# EAGLE board SensorBoard (EAGLE 6.5.0)
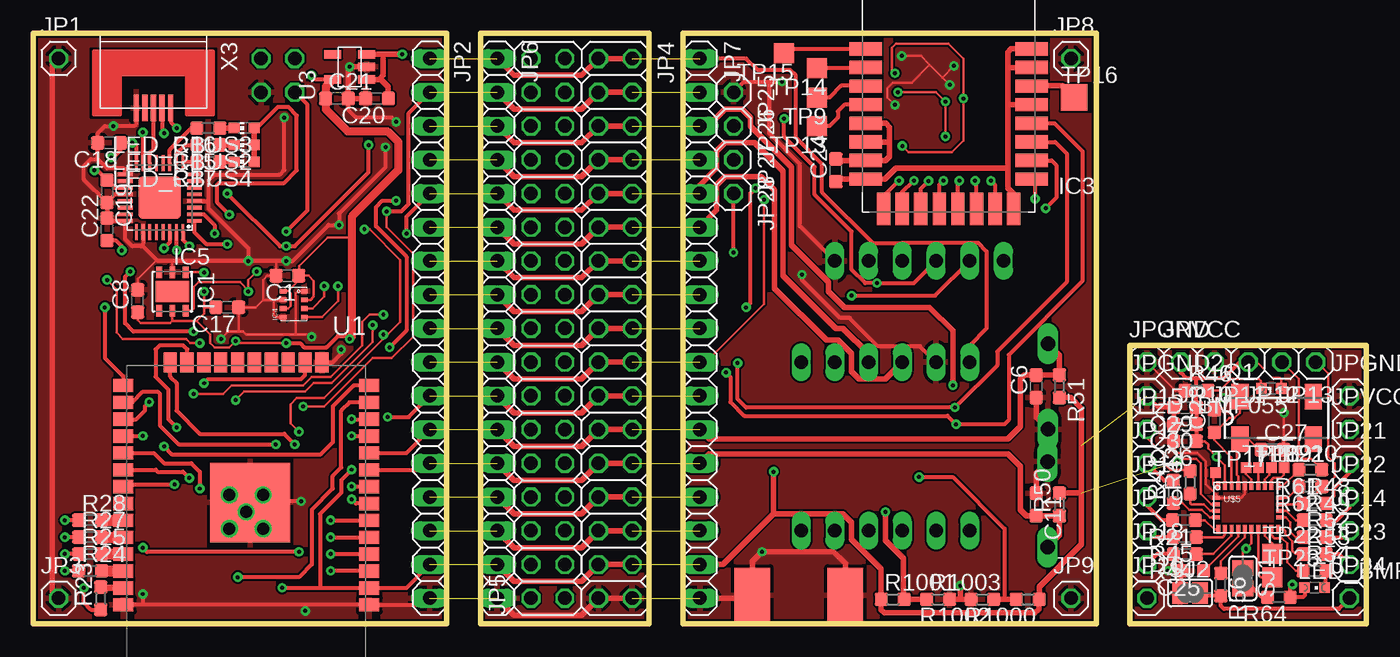
[diagram p4: board, top side]
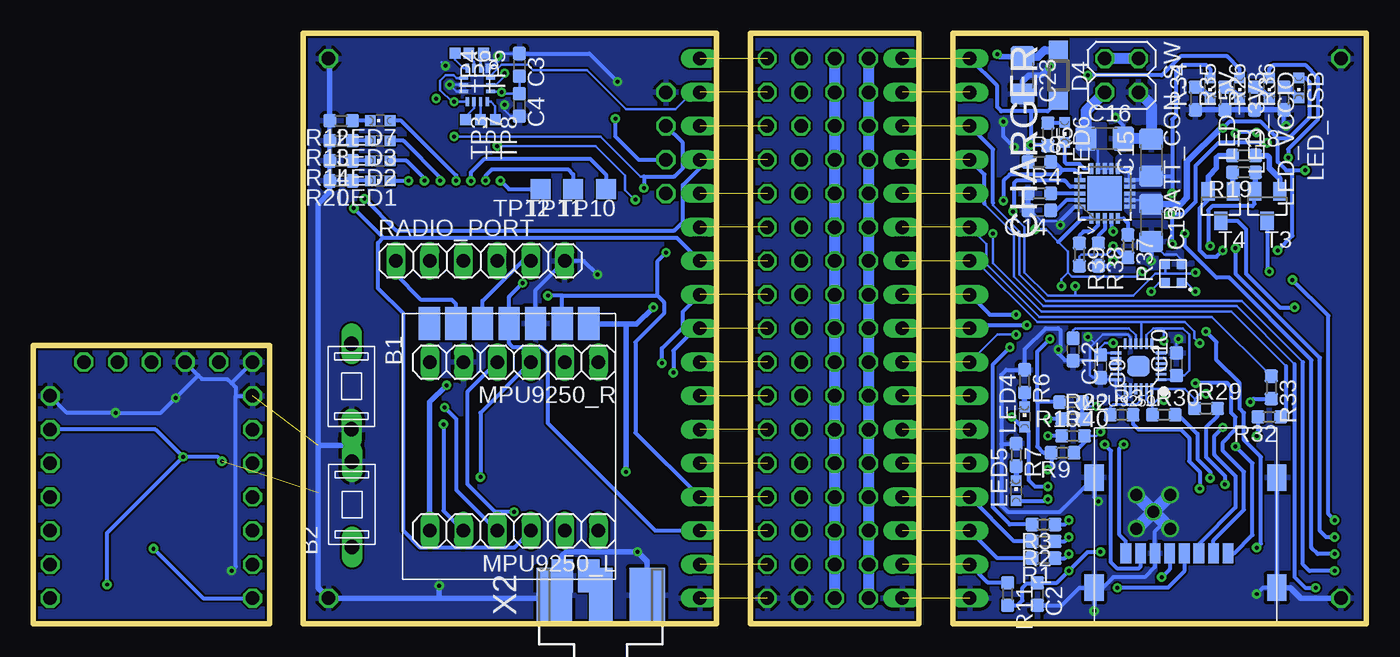
[diagram p5: board, bottom side, seen from below]

Size 100.33 x 44.45 mm. Coordinates in mm from the lower left corner, seen from the top.
Outline: 80.01,0 80.01,44.45 48.9,44.45 48.9,0 80.01,0
Outline: 46.35,0 46.35,44.45 33.66,44.45 33.66,0 46.35,0
Outline: 31.11,0 31.11,44.44 0,44.44 0,0 31.11,0
Outline: 82.55,0 100.33,0 100.33,20.95 82.55,20.95 82.55,0
Copper layers (1*16): Top 0.035mm / dielectric 1.5mm / Bottom 0.035mm
Design rules "gatema_2layers": minimum track width 0.15mm, minimum drill 0.3mm, track to track 0.15mm, track to pad 0.15mm, pad to pad 0.15mm, via to via 0.15mm, smd to smd 0mil, copper to edge 0.15mm, drill to drill 0.4mm, minimum pad ring 0.2mm, minimum via ring 0.2mm, stop-mask expansion 2mil, vias tented up to drill 0.4mm, thermal gap 10mil
bRestrict: 1 lines

## Footprints (pad centres in the part's own frame; a part is rotated, then mirrored left to right if it is on the bottom)
TACTM-35N-F = drill 1.1 long: P$2 3.231,-0.02; P$4 -3.204,-0.02
2X02 = drill 1.016 octagon: 1 -1.27,-1.27; 2 -1.27,1.27; 3 1.27,-1.27; 4 1.27,1.27
C0603 = smd 1 x 1: 1 -0.85,0; 2 0.85,0
C1206 = smd 1.6 x 1.8: 1 -1.4,0; 2 1.4,0
QFN50P400X400X80-21N = smd 0.813 x 0.305: 1 -1.88,0.991; 2 -1.88,0.508; 3 -1.88,0; 4 -1.88,-0.508; 5 -1.88,-0.991; 11 1.88,-0.991; 12 1.88,-0.508; 13 1.88,0; 14 1.88,0.508; 15 1.88,0.991 | smd 0.305 x 0.813: 6 -0.991,-1.88; 7 -0.508,-1.88; 8 0,-1.88; 9 0.508,-1.88; 10 0.991,-1.88; 16 0.991,1.88; 17 0.508,1.88; 18 0,1.88; 19 -0.508,1.88; 20 -0.991,1.88 | smd 2.591 x 2.591: 21 0,0
SOD123 = smd 1.4 x 1.4: A 1.9,0; C -1.9,0
DFN6-3X3 = smd 0.85 x 0.45: 1 -1.45,1; 2 -1.45,0; 3 -1.45,-1; 4 1.45,-1; 5 1.45,0; 6 1.45,1 | smd 1.6 x 2.5: EXP 0,0
DWM1000 = smd 2.45 x 1: 1 -6.25,0.8; 2 -6.25,-0.6; 3 -6.25,-2; 4 -6.25,-3.4; 5 -6.25,-4.8; 6 -6.25,-6.2; 7 -6.25,-7.6; 8 -6.25,-9; 17 6.25,-9; 18 6.25,-7.6; 19 6.25,-6.2; 20 6.25,-4.8; 21 6.25,-3.4; 22 6.25,-2; 23 6.25,-0.6; 24 6.25,0.8 | smd 1 x 2.45: 9 -4.9,-11.25; 10 -3.5,-11.25; 11 -2.1,-11.25; 12 -0.7,-11.25; 13 0.7,-11.25; 14 2.1,-11.25; 15 3.5,-11.25; 16 4.9,-11.25
BMP280 = smd 0.35 x 0.5: 1 0.975,-0.8; 2 0.325,-0.8; 3 -0.325,-0.8; 4 -0.975,-0.8; 5 -0.975,0.8; 6 -0.325,0.8; 7 0.325,0.8; 8 0.975,0.8
QFN32_LONG_PADS = smd 1.2 x 0.3: 1 -2.6,1.75; 2 -2.6,1.25; 3 -2.6,0.75; 4 -2.6,0.25; 5 -2.6,-0.25; 6 -2.6,-0.75; 7 -2.6,-1.25; 8 -2.6,-1.75; 17 2.6,-1.75; 18 2.6,-1.25; 19 2.6,-0.75; 20 2.6,-0.25; 21 2.6,0.25; 22 2.6,0.75; 23 2.6,1.25; 24 2.6,1.75 | smd 0.3 x 1.2: 9 -1.75,-2.6; 10 -1.25,-2.6; 11 -0.75,-2.6; 12 -0.25,-2.6; 13 0.25,-2.6; 14 0.75,-2.6; 15 1.25,-2.6; 16 1.75,-2.6; 25 1.75,2.6; 26 1.25,2.6; 27 0.75,2.6; 28 0.25,2.6; 29 -0.25,2.6; 30 -0.75,2.6; 31 -1.25,2.6; 32 -1.75,2.6 | smd 3.2 x 3.2: EXP 0,0
1X01 = drill 1.016 octagon: 1 0,0
1X17 = drill 1.016 long: 1 -20.32,0; 2 -17.78,0; 3 -15.24,0; 4 -12.7,0; 5 -10.16,0; 6 -7.62,0; 7 -5.08,0; 8 -2.54,0; 9 0,0; 10 2.54,0; 11 5.08,0; 12 7.62,0; 13 10.16,0; 14 12.7,0; 15 15.24,0; 16 17.78,0; 17 20.32,0
2X17 = drill 1.016 octagon: 1 -20.32,-1.27; 2 -20.32,1.27; 3 -17.78,-1.27; 4 -17.78,1.27; 5 -15.24,-1.27; 6 -15.24,1.27; 7 -12.7,-1.27; 8 -12.7,1.27; 9 -10.16,-1.27; 10 -10.16,1.27; 11 -7.62,-1.27; 12 -7.62,1.27; 13 -5.08,-1.27; 14 -5.08,1.27; 15 -2.54,-1.27; 16 -2.54,1.27; 17 0,-1.27; 18 0,1.27; 19 2.54,-1.27; 20 2.54,1.27; 21 5.08,-1.27; 22 5.08,1.27; 23 7.62,-1.27; 24 7.62,1.27; 25 10.16,-1.27; 26 10.16,1.27; 27 12.7,-1.27; 28 12.7,1.27; 29 15.24,-1.27; 30 15.24,1.27; 31 17.78,-1.27; 32 17.78,1.27; 33 20.32,-1.27; 34 20.32,1.27
CHIPLED_0603 = smd 0.8 x 0.8: A 0,-0.75; C 0,0.75
CHIP-LED0603 = smd 0.8 x 0.8: A 0,-0.75; C 0,0.75
LEAD-QFN24 = smd 0.8 x 0.2: 1 -1.7,1; 2 -1.7,0.6; 3 -1.7,0.2; 4 -1.7,-0.2; 5 -1.7,-0.6; 6 -1.7,-1; 13 1.7,-1; 14 1.7,-0.6; 15 1.7,-0.2; 16 1.7,0.2; 17 1.7,0.6; 18 1.7,1 | smd 0.2 x 0.8: 7 -1,-1.7; 8 -0.6,-1.7; 9 -0.2,-1.7; 10 0.2,-1.7; 11 0.6,-1.7; 12 1,-1.7; 19 1,1.7; 20 0.6,1.7; 21 0.2,1.7; 22 -0.2,1.7; 23 -0.6,1.7; 24 -1,1.7 | smd 1.7 x 1.54: 25 0,0
1X06 = drill 1.016 long: 1 -6.35,0; 2 -3.81,0; 3 -1.27,0; 4 1.27,0; 5 3.81,0; 6 6.35,0
MC-306 = smd 1.3 x 1.9: 1 -2.75,-1.6; 2 2.75,-1.6; 3 2.75,1.6; 4 -2.75,1.6
R0603 = smd 1 x 1: 1 -0.85,0; 2 0.85,0
SJ = smd 1.168 x 1.6: 1 -0.762,0; 2 0.762,0
SOT23 = smd 1 x 1.4: 1 -0.95,-1.1; 2 0.95,-1.1; 3 0,1.1
TP08SQ = smd 0.8 x 0.8: TP 0,0
TP15SQ = smd 1.5 x 1.5: TP 0,0
TP20SQ = smd 2 x 2: TP 0,0
ESP-WROOM-32 = smd 1.5 x 1: 1 -9.25,7; 2 -9.25,5.73; 3 -9.25,4.46; 4 -9.25,3.19; 5 -9.25,1.92; 6 -9.25,0.65; 7 -9.25,-0.62; 8 -9.25,-1.89; 9 -9.25,-3.16; 10 -9.25,-4.43; 11 -9.25,-5.7; 12 -9.25,-6.97; 13 -9.25,-8.24; 14 -9.25,-9.51; 25 9.25,-9.51; 26 9.25,-8.24; 27 9.25,-6.97; 28 9.25,-5.7; 29 9.25,-4.43; 30 9.25,-3.16; 31 9.25,-1.89; 32 9.25,-0.62; 33 9.25,0.65; 34 9.25,1.92; 35 9.25,3.19; 36 9.25,4.46; 37 9.25,5.73; 38 9.25,7 | smd 1 x 1.5: 15 -5.7,-11.25; 16 -4.43,-11.25; 17 -3.16,-11.25; 18 -1.89,-11.25; 19 -0.62,-11.25; 20 0.65,-11.25; 21 1.92,-11.25; 22 3.19,-11.25; 23 4.46,-11.25; 24 5.73,-11.25 | smd 6 x 6: GND -0.3,-0.7
SOT23-5 = smd 0.635 x 1.27: P$1 -0.95,-1.27; P$2 0,-1.27; P$3 0.95,-1.27; P$4 0.95,1.27; P$5 -0.95,1.27
HM-TRP = smd 1.6 x 2.5: !CONFIG 10,0.75; !ENABLE 12,0.75; ANT 2,19.75; DRX 8,0.75; DTX 4,0.75; GND 6,0.75; GND_RF 4,19.75; TEST 14,0.75; VCC 2,0.75
MOLEX:47219-2001 = smd 1.45 x 2: G1 13.75,0; G2 13.75,8.3; G3 0,8.3; G4 0,0 | smd 0.8 x 1.5: P1 10.08,2.6; P2 8.98,2.6; P3 7.88,2.6; P4 6.78,2.6; P5 5.68,2.6; P6 4.58,2.6; P7 3.48,2.6; P8 2.38,2.6
LGA14-BMI160 = smd 0.675 x 0.25: P$1 -1.262,0.75; P$2 -1.262,0.25; P$3 -1.262,-0.25; P$4 -1.262,-0.75; P$8 1.262,-0.75; P$9 1.262,-0.25; P$10 1.262,0.25; P$11 1.262,0.75 | smd 0.25 x 0.675: P$5 -0.5,-1.012; P$6 0,-1.012; P$7 0.5,-1.012; P$12 0.5,1; P$13 0,1; P$14 -0.5,1
CHIPLED-4 = smd 0.7 x 0.75: 1 -0.6,0.7; 2 -0.6,-0.7; 3 0.6,-0.7; 4 0.6,0.7
LGA-28 = smd 0.3 x 0.65: P$1 -2.25,1.643; P$6 -2.25,-1.643; P$7 -1.75,-1.643; P$8 -1.25,-1.643; P$9 -0.75,-1.643; P$10 -0.25,-1.643; P$11 0.25,-1.643; P$12 0.75,-1.643; P$13 1.25,-1.643; P$14 1.75,-1.643; P$15 2.25,-1.643; P$20 2.25,1.643; P$21 1.75,1.643; P$22 1.25,1.643; P$23 0.75,1.643; P$24 0.25,1.643; P$25 -0.25,1.643; P$26 -0.75,1.643; P$27 -1.25,1.643; P$28 -1.75,1.643 | smd 0.55 x 0.3: P$2 -2.41,0.75; P$3 -2.41,0.25; P$4 -2.41,-0.25; P$5 -2.41,-0.75; P$16 2.39,-0.75; P$17 2.39,-0.25; P$18 2.39,0.25; P$19 2.39,0.75
J502-ND-142-0711-821/826 = smd 4.191 x 1.778: 1 2.115,0 | smd 4.191 x 2.667: G@1 2.115,3.495; G@2 2.115,-3.495 | smd 4.191 x 2.667 bottom: G@3 2.115,3.495; G@4 2.115,-3.495
USB-MICRO-B-BOTTOM-MOLEX = smd 2 x 0.4: 1 5,1.3; 2 5,0.65; 3 5,0; 4 5,-0.65; 5 5,-1.3

## Placement (x,y rotation side)
B1  TACTM-35N-F  [TACTM-35N-F]  76.36,17.86 270 bottom
B2  TACTM-35N-F  [TACTM-35N-F]  76.36,8.97 90 bottom
BATT_CON_SW  [2X02]  18.41,41.27 270 bottom
C1  100n  [C0603]  19.13,26.19 180 top
C2  1n  [C0603]  24.77,2.22 270 bottom
C3  100n  [C0603]  63.74,42.07 270 bottom
C4  100n  [C0603]  63.74,39.05 270 bottom
C6  100n/16V  [C0603]  75.49,17.86 90 top
C8  100n  [C0603]  7.86,24.29 90 top
C9  100n/16V  [C0603]  20,19.37 270 bottom
C10  10n/16V  [C0603]  14.29,19.53 90 bottom
C11  100n/16V  [C0603]  75.49,8.97 270 top
C12  100n/16V  [C0603]  22.07,20.64 270 bottom
C13  10uF  [C1206]  16.19,30.16 270 bottom
C14  10n  [C0603]  24.61,31.11 180 bottom
C15  22uF  [C1206]  16.19,35.08 90 bottom
C16  22uF  [C1206]  19.68,36.51 0 bottom
C17  100n  [C0603]  14.61,23.81 180 top
C18  100n  [C0603]  5.71,36.2 180 top
C19  4u7  [C0603]  5.56,32.54 270 top
C20  100n  [C0603]  25.88,39.53 180 top
C21  4u7  [C0603]  22.86,39.53 0 top
C22  100n  [C0603]  5.56,29.69 90 top
C23  22u/16V  [C1206]  25.88,41.27 270 bottom
C24  100n  [C0603]  60.4,34.13 90 top
C25  100n  [C0603]  87.23,3.97 180 top
C26  100n  [C0603]  86.68,13.73 180 top
C27  12.5pF  [C0603]  93.27,13.1 0 top
C28  12.5pF  [C0603]  88.9,15.24 90 top
C29  120n  [C0603]  86.68,16.27 180 top
C30  6.8n  [C0603]  86.68,15 180 top
CHARGER  ADP5062  [QFN50P400X400X80-21N]  19.68,32.38 90 bottom
D4  skl34  [SOD123]  23.18,41.27 270 bottom
IC1  SI7006-A10-IM  [DFN6-3X3]  10.48,25 270 top
IC3  DWM1000  [DWM1000]  68.9,42.47 0 top
IC4  BMP280  [BMP280]  19.61,24.05 90 top
IC5  FT232R  [QFN32_LONG_PADS]  9.53,32.07 180 top
JP1  [1X01]  1.91,42.55 0 top
JP2  [1X17]  29.84,22.23 270 top
JP3  [1X01]  1.91,1.91 0 top
JP4  [2X17]  43.81,22.23 270 top
JP5  [2X17]  38.73,22.23 90 top
JP6  [1X17]  34.92,22.23 270 top
JP7  [1X17]  50.16,22.23 270 top
JP8  [1X01]  78.11,42.55 0 top
JP9  [1X01]  78.11,1.91 0 top
JP10  [1X01]  88.9,19.68 180 top
JP11  [1X01]  91.44,19.68 180 top
JP12  [1X01]  93.98,19.68 180 top
JP13  [1X01]  96.52,19.68 180 top
JP14  [1X01]  99.06,6.99 0 top
JP15  [1X01]  83.82,14.61 0 top
JP16  [1X01]  83.82,9.53 0 top
JP17  [1X01]  83.82,12.06 0 top
JP18  [1X01]  83.82,4.45 0 top
JP19  [1X01]  83.82,6.99 0 top
JP20  [1X01]  83.82,1.91 0 top
JP21  [1X01]  99.06,12.06 0 top
JP22  [1X01]  99.06,9.53 0 top
JP23  [1X01]  99.06,4.45 0 top
JP24  [1X01]  99.06,1.91 0 top
JP25  [1X01]  52.7,40.01 270 top
JP26  [1X01]  52.7,37.47 270 top
JP27  [1X01]  52.7,34.92 270 top
JP28  [1X01]  52.7,32.38 270 top
JPGND  [1X01]  83.82,19.68 0 top
JPGND1  [1X01]  99.06,17.14 0 top
JPGND2  [1X01]  83.82,17.14 0 top
JPVCC  [1X01]  86.36,19.68 0 top
JPVCC1  [1X01]  99.06,14.61 0 top
LED1  yellow  [CHIPLED_0603]  74.22,33.34 90 bottom
LED2  yellow  [CHIPLED_0603]  74.22,34.85 90 bottom
LED3  yellow  [CHIPLED_0603]  74.22,36.35 90 bottom
LED4  green  [CHIPLED_0603]  25.72,15.56 0 bottom
LED5  green  [CHIPLED_0603]  26.35,10 0 bottom
LED6  green  [CHIPLED_0603]  22.7,36.99 180 bottom
LED7  yellow  [CHIPLED_0603]  74.22,37.86 90 bottom
LED_3V3  red  [CHIPLED_0603]  9.53,40.32 180 bottom
LED_5V  red  [CHIPLED_0603]  11.75,40.32 180 bottom
LED_BMF  red  [CHIPLED_0603]  96.44,2.7 270 top
LED_BMF055  red  [CHIPLED_0603]  93.19,17.7 90 top
LED_CBUS2  yellow  [CHIP-LED0603]  15.88,36.04 90 top
LED_CBUS3  yellow  [CHIP-LED0603]  15.88,37.31 90 top
LED_CBUS4  yellow  [CHIP-LED0603]  15.88,34.77 90 top
LED_USB  red  [CHIPLED_0603]  5.08,40.32 180 bottom
LED_VCCIO  red  [CHIPLED_0603]  7.3,40.32 180 bottom
MPU9250  MPU-9250  [LEAD-QFN24]  17.14,19.37 180 bottom
MPU9250_L  [1X06]  64.14,6.99 180 bottom
MPU9250_R  [1X06]  64.14,19.68 180 bottom
Q1  MC-306  [MC-306]  93.58,15.48 0 top
R1  470R  [R0603]  24.29,4.92 180 bottom
R2  470R  [R0603]  24.29,6.19 180 bottom
R3  470R  [R0603]  24.29,7.46 180 bottom
R4  10k  [R0603]  24.61,32.38 0 bottom
R5  470R  [R0603]  23.97,36.83 270 bottom
R6  470R  [R0603]  25.72,18.26 270 bottom
R7  470R  [R0603]  26.35,12.7 270 bottom
R8  470R  [R0603]  24.61,34.77 0 bottom
R9  5k  [R0603]  22.86,12.86 180 bottom
R10  5k  [R0603]  22.23,16.67 180 bottom
R11  12k  [R0603]  26.99,2.22 270 bottom
R12  470R  [R0603]  77.15,37.86 180 bottom
R13  470R  [R0603]  77.15,36.35 180 bottom
R14  470R  [R0603]  77.15,34.85 180 bottom
R15  180R  [R0603]  13.18,36.04 180 top
R16  180R  [R0603]  13.18,37.31 180 top
R17  180R  [R0603]  13.18,34.77 180 top
R18  10k  [R0603]  9.21,35.24 0 bottom
R19  10k  [R0603]  9.21,33.97 180 bottom
R20  470R  [R0603]  77.15,33.34 180 bottom
R21  470R  [R0603]  86.6,7.78 180 top
R22  470R  [R0603]  22.07,15.4 0 bottom
R23  470R  [R0603]  5.08,1.91 90 top
R24  470R  [R0603]  4.29,3.97 0 top
R25  470R  [R0603]  4.29,5.24 0 top
R26  470R  [R0603]  8.41,39.53 90 bottom
R27  470R  [R0603]  4.29,6.51 0 top
R28  470R  [R0603]  4.29,7.78 0 top
R29  470R  [R0603]  12.06,16.19 0 bottom
R30  470R  [R0603]  15.24,15.72 0 bottom
R31  470R  [R0603]  18.41,15.72 0 bottom
R32  470R  [R0603]  7.3,15.56 180 bottom
R33  470R  [R0603]  7.14,17.78 270 bottom
R34  470R  [R0603]  12.86,39.53 90 bottom
R35  470R  [R0603]  10.64,39.53 90 bottom
R36  470R  [R0603]  6.19,39.53 90 bottom
R37  470R  [R0603]  17.94,28.42 270 bottom
R38  470R  [R0603]  20.16,27.78 270 bottom
R39  470R  [R0603]  21.59,27.78 270 bottom
R40  470R  [R0603]  22.07,14.13 0 bottom
R41  470R  [R0603]  85.8,9.92 90 top
R42  470R  [R0603]  87.07,10.64 90 top
R44  470R  [R0603]  86.68,5.24 180 top
R45  470R  [R0603]  86.68,6.51 180 top
R46  470R  [R0603]  87.55,17.54 0 top
R48  470R  [R0603]  96.44,9.05 0 top
R49  470R  [R0603]  96.44,7.78 0 top
R50  10k  [R0603]  77.23,8.97 90 top
R51  10k  [R0603]  77.23,17.86 270 top
R52  470R  [R0603]  96.44,6.51 0 top
R53  470R  [R0603]  96.44,5.24 0 top
R54  470R  [R0603]  96.44,3.97 0 top
R56  470R  [R0603]  89.38,2.94 270 top
R61  470R  [R0603]  96.12,11.59 180 top
R62  470R  [R0603]  96.12,10.32 180 top
R64  10k  [R0603]  93.74,1.98 180 top
R1000  n/a  [R0603]  74.85,1.83 180 top
R1001  n/a  [R0603]  64.69,1.83 0 top
R1002  n/a  [R0603]  71.44,1.83 180 top
R1003  n/a  [R0603]  68.1,1.83 0 top
RADIO_PORT  [1X06]  66.67,27.3 0 bottom
SJ1  [SJ]  91.04,3.41 270 top
SJ2  [SJ]  87.07,2.3 0 top
T3  BC337  [SOT23]  7.46,31.43 180 bottom
T4  BC337  [SOT23]  10.95,31.43 180 bottom
TP3  TPTP08SQ  [TP08SQ]  67.79,37.94 270 bottom
TP4  TPTP08SQ  [TP08SQ]  68.58,42.94 270 bottom
TP5  TPTP08SQ  [TP08SQ]  66.44,42.94 270 bottom
TP6  TPTP08SQ  [TP08SQ]  67.55,42.94 270 bottom
TP7  TPTP08SQ  [TP08SQ]  66.67,37.94 270 bottom
TP8  TPTP08SQ  [TP08SQ]  65.56,37.94 270 bottom
TP9  TPTP15SQ  [TP15SQ]  58.98,39.61 180 top
TP10  TPTP15SQ  [TP15SQ]  57.23,32.7 180 bottom
TP11  TPTP15SQ  [TP15SQ]  59.69,32.7 180 bottom
TP12  TPTP15SQ  [TP15SQ]  62.15,32.7 180 bottom
TP13  TPTP15SQ  [TP15SQ]  58.98,37.47 180 top
TP14  TPTP15SQ  [TP15SQ]  58.98,41.83 180 top
TP15  TPTP15SQ  [TP15SQ]  56.52,42.94 180 top
TP16  TPTP20SQ  [TP20SQ]  78.34,39.61 0 top
TP17  TPTP08SQ  [TP08SQ]  88.98,11.35 0 top
TP18  TPTP08SQ  [TP08SQ]  91.28,11.75 0 top
TP19  TPTP08SQ  [TP08SQ]  92.23,11.75 0 top
TP20  TPTP08SQ  [TP08SQ]  94.14,11.75 0 top
TP21  TPTP08SQ  [TP08SQ]  93.19,11.75 0 top
TP22  TPTP15SQ  [TP15SQ]  93.27,5.24 0 top
TP23  TPTP15SQ  [TP15SQ]  93.27,3.49 0 top
U1  ESP-WROOM-32  [ESP-WROOM-32]  16.03,8.41 180 top
U3  UM18533  [SOT23-5]  23.81,41.91 90 top
U$1  HM-TRP  [HM-TRP]  56.52,23.34 180 bottom
U$2  MOLEX-47219-2001  [MOLEX:47219-2001]  20.48,2.7 0 bottom
U$3  BMI160LGA14  [LGA14-BMI160]  66.91,40.56 270 bottom
U$4  LTR-329ALS-01  [CHIPLED-4]  14.53,26.35 180 bottom
U$5  BMF055  [LGA-28]  91.44,8.73 0 top
X2  SMA-142-0711-821/826  [J502-ND-142-0711-821/826]  57.63,0 90 bottom
X3  USB-MICRO-B-BOTTOM  [USB-MICRO-B-BOTTOM-MOLEX]  9.05,43.81 270 top

## Tracks (layer width: path | path; a pad name or v marks a point on that pad's centre or on a via)
5V->3V3  (via drill 0.3)
  Top 0.305: 26.35,42.55 26.35,42.86 26.36,42.86
  Top 0.406: 26.35,42.55 26.35,41.27 26.11,41.04 | 26.11,41.04 26.04,40.96 U3.P$1 | C20.1 26.73,40.42 26.11,41.04 | U3.P$3 26.36,42.86 v27.78,42.86
  Bottom 0.406: C23.1 27.59,42.67 v27.78,42.86
  Bottom 0.6: C23.1 24.71,42.67 24.21,43.18 D4.C
!DTR  (via drill 0.3)
  Top 0.305: IC5.31 10.78,28.12 v10.79,28.1
  Bottom 0.305: v10.79,28.1 11.27,27.62 12.06,27.62 12.54,28.1 12.54,31.27 11.91,31.91 T4.2
  Bottom 0.406: R18.1 11.11,35.24 11.27,35.08 11.27,34.29 11.91,33.66 T4.2
!DTR_B
  Bottom 0.406: T3.1 6.51,33.5 7.3,34.29 7.3,35.08 7.46,35.24 R18.2
!RTS  (via drill 0.3)
  Top 0.305: IC5.32 11.28,28.89 v11.75,28.42
  Bottom 0.305: T3.2 8.41,31.59 8.57,31.43 11.59,31.43 11.91,31.11 11.91,28.57 v11.75,28.42
  Bottom 0.406: R19.1 8.36,32.59 T3.2
!RTS_B
  Bottom 0.406: R19.2 10.06,32.59 T4.1
+3V3  (via drill 0.3)  (3 unrouted)
  Top 0.2: v19.05,21.11 15.4,21.11 v15.24,21.27 14.76,20.8 13.65,20.8 13.34,21.11 13.34,21.75 12.3,22.78 | IC1.5 10.48,22.78 | 10.48,22.78 10.32,22.62 8.1,22.62 7.86,22.86 C8.1 | 10.48,22.78 12.3,22.78 | IC4.8 19.19,25.03 | 19.19,25.03 19.37,24.84 19.37,23.89 19.2,23.73 IC4.6 | 19.19,25.03 19.98,25.82 C1.1 | 23.97,29.05 22.15,29.05 20,26.91 20,26.22 C1.1 | IC4.2 20.88,24.38 21.11,24.61 21.11,25.8 20.72,26.19 C1.1 | 12.3,22.78 12.86,23.34 12.86,23.81 | 12.86,23.81 v12.86,25 | C17.2 12.86,23.81 | v65.09,40.01 67.94,40.01 v68.66,39.29 v68.66,36.67 | U$5.P$28 89.69,11.91 v89.06,12.54 88.42,13.18 88.42,13.49 88.19,13.73 C26.1 | U$5.P$3 88.65,8.98 87.87,9.76 87.87,12.06 87.55,12.38 86.28,12.38 v86.12,12.22 | LED_BMF055.A 93.94,18.38 93.82,18.49 93.27,18.49 92.08,19.68 JP11.1
  Top 0.305: v18.73,2.7 21.59,2.7 | 21.59,2.7 25.27,2.7 U1.2 28.08,2.68 JP2.16 | U3.P$5 21.27,40.96 v20.95,41.27 | v23.97,11.59 23.18,10.79 23.18,9.84 21.59,8.26 21.59,2.7 | v19.05,21.11 20.08,21.11 20.4,20.8 22.07,20.8 22.94,21.67 23.57,21.67 v23.81,21.43 | C26.1 C30.1 C29.1 87.53,18.49 | LED_BMF.A 95.69,2.11 95.57,1.98 R64.1 94.59,2.75 v94.77,2.94 | v53.66,23.81 53.98,24.13 53.98,32.38 v54.37,32.78 | JPVCC.1 86.36,18.89 86.76,18.49 87.53,18.49 | 87.53,18.49 89.61,18.49 90.81,19.68 JP11.1
  Top 0.406: JP6.16 36.2,3.17 41.27,3.17 JP4.31 JP4.32 | 55.72,8.26 60.96,8.26 61.59,7.62 61.59,6.35 63.82,4.13 63.82,1.85 R1001.1 63.82,1.8 63.82,1.03 64.06,0.79 75.41,0.79 75.7,1.09 R1000.1 75.72,1.85 75.72,2.78 78.9,5.95 78.9,9.84 | 55.72,8.26 51.91,4.45 JP7.16 | R51.2 78.08,17.01 78.9,16.19 78.9,9.84 | R50.2 77.25,9.84 78.9,9.84 | 55.72,8.26 v55.72,11.43
  Top 0.6: 23.97,29.05 23.97,21.59 v23.81,21.43
  Top 0.61: U3.P$5 22.01,40.43 C21.1 22.01,38.71 23.65,37.07 26.67,37.07 27.46,36.27 27.46,34.13 23.97,30.64 23.97,29.05
  Bottom 0.2: MPU9250.13 19.85,20.37 C9.1 20,20.8 19.68,21.11 v19.05,21.11 | MPU9250.1 14.6,18.37 C10.1 13.71,18.68 13.34,19.05 13.34,21.75 13.81,22.23 15.24,22.23 | MPU9250.8 16.55,21.71 16.03,22.23 15.24,22.23 | 15.24,22.23 v15.24,21.27 | U$4.1 13.51,25.65 v12.86,25 | U$3.P$5 68.48,41.06 68.69,41.27 69.29,41.27 69.69,40.88 69.69,40.56 | U$3.P$8 67.67,39.29 v68.66,39.29 68.82,39.29 69.69,40.16 69.69,40.56 | U$3.P$12 65.14,40.06 v65.09,40.01 64.98,39.9 C4.1 C3.2 | 69.71,40.58 69.69,40.56 | v68.66,36.67 57.63,36.67 54.61,33.66 54.37,33.66
  Bottom 0.305: U$2.P4 13.7,3.92 14.92,2.7 v18.73,2.7 | 9.53,41.12 LED_3V3.A 9.53,41.75 10.48,42.7 13.97,42.7 15.4,41.27 v20.95,41.27 | v23.97,11.59 23.71,11.85 R9.2 24.29,12.86 24.77,13.34 24.77,16.67 | R10.2 24.77,16.67 | 24.77,16.67 24.77,20.48 v23.81,21.43 | R11.1 28.47,3.07 JP2.16 | v89.06,12.54 86.44,12.54 v86.12,12.22 | v94.77,2.94 94.77,6.83 v89.06,12.54 | JP26.1 51.44,36.2 51.44,34.29 52.07,33.66 54.37,33.66 v54.37,32.78 | v89.06,12.54 91.12,14.61 JPVCC1.1
  Bottom 0.406: v55.72,11.43 55.72,22.54 | 55.72,22.54 58.47,22.54 U$1.VCC | 55.72,22.54 54.93,22.54 v53.66,23.81
+5V  (via drill 0.3)  (2 unrouted)
  Top 0.305: v14.61,32.38 18.57,28.42 v19.05,28.42 19.68,28.42 25.24,33.97 v25.24,36.04 | 65.41,28.65 71.12,28.65 71.75,28.02 71.75,22.23 70.48,20.95 MPU9250_R.6 | 65.41,28.65 RADIO_PORT.4 | 65.41,28.65 63.18,28.65 59.37,32.46 59.37,34.61 57.39,36.59 57.39,41.27 56.99,41.67 54.53,41.67 53.66,42.55 JP7.1
  Top 0.406: JP6.1 36.2,41.27 41.27,41.27 JP4.1 JP4.2
  Bottom 0.2: R39.2 21.59,27.62 21.43,27.78 19.53,27.78 19.05,28.26 v19.05,28.42
  Bottom 0.305: CHARGER.10 17.78,33.4 17.78,33.97 18.1,34.29 18.67,34.29 CHARGER.11 | LED_5V.A 11.75,41.75 12.06,42.07 13.81,42.07 14.29,41.59 14.29,38.26 14.61,37.94 14.61,33.66 | 14.61,33.66 v14.61,32.38 | v19.05,28.42 18.2,27.57 R37.2 | 14.61,33.66 16.16,33.66 C15.1 | 25.24,38.58 v25.24,36.04 | 23.49,39.38 D4.A 23.98,38.58 25.24,38.58 | R5.2 24.34,35.98 24.4,36.04 v25.24,36.04 | v25.24,36.04 25.46,35.82 R8.1 | 25.24,38.58 27.46,38.58 27.78,38.89 27.78,40.48 JP2.1 | CHARGER.10 CHARGER.9 | 16.5,33.38 CHARGER.10
  Bottom 0.813: C15.1 16.5,33.38
  pour Bottom (no thermals): 18.1,32.86 18.1,33.81 18.26,33.97 18.73,33.97 18.73,35.08 18.57,35.24 14.61,35.24 14.61,32.86
BAT_OK  (via drill 0.3)
  Top 0.305: v26.83,20.8 28.1,22.07 28.1,27.62 25.8,29.92 25.8,31.35 26.27,31.83 v27.3,31.83
  Bottom 0.305: CHARGER.16 21.57,33.79 21.91,34.13 22.86,34.13 | 22.86,34.13 23.18,33.81 26.83,33.81 27.3,33.34 v27.3,31.83 | R8.2 23.5,34.77 22.86,34.13 | R3.2 26.83,7.46 28.1,8.73 28.1,19.53 v26.83,20.8
BMF_M0
  Top 0.305: R52.2 98.58,6.51 JP14.1
BMF_M1
  Top 0.2: R42.2 86.97,11.59 85.57,11.59 85.09,12.06 85.09,12.7 83.82,13.97 JP15.1
BMF_M2
  Top 0.305: R21.2 84.93,7.78 83.82,8.89 JP16.1
BMF_M3
  Top 0.305: R41.2 85.11,10.77 JP17.1
BMF_PA20
  Top 0.305: R48.2 97.87,9.63 97.87,10.16 99.06,11.35 JP21.1
BMF_PA21
  Top 0.305: R49.2 98.11,7.78 99.06,8.73 JP22.1
BMF_PA23
  Top 0.305: R53.2 98.27,5.24 JP23.1
BMF_PA28
  Top 0.305: 87.89,2.25 SJ2.2 88.05,2.09 R56.2 89.38,1.35 89.61,1.11 98.27,1.11 JP24.1
BMF_RESET  (via drill 0.3)
  Top 0.2: U$5.P$11 91.69,6.04 v91.28,5.64 91.04,5.4 SJ1.1
  Bottom 0.305: v91.28,5.64 87.55,1.91 JP20.1
BMF_RX
  Top 0.2: R62.1 97.23,10.32 97.95,11.03 97.95,12.06 97.47,12.54 97.47,18.81 96.6,19.68 JP13.1
BMF_SWCLK
  Top 0.305: R44.2 84.61,5.24 JP18.1
BMF_SWDIO
  Top 0.305: R45.2 84.3,6.51 JP19.1
BMF_TX
  Top 0.2: R61.1 96.18,12.38 95.49,12.38 95.25,12.62 95.25,18.41 JP12.1
BTN0  (2 unrouted)
  Top 0.305: U1.10 28.08,12.84 JP2.12
  Top 0.406: JP6.12 36.2,13.34 41.27,13.34 JP4.23 JP4.24 | B1.P$4 77.23,20.21 R51.1 C6.2 74.59,18.71 74.3,18.41 74.3,14.84 73.34,13.89 50.88,13.89 JP7.12
BTN1  (2 unrouted)
  Top 0.305: U1.9 29.35,11.57 JP2.13
  Top 0.406: JP6.13 36.2,10.79 41.27,10.79 JP4.25 JP4.26 | B2.P$4 77.23,6.66 R50.1 C11.2 74.75,8.12 74.3,8.57 74.3,11.83 73.34,12.78 50.88,12.78 JP7.13
CBUS2
  Top 0.305: IC5.10 10.78,35.38 11.43,36.04 R15.2
CBUS2_LED
  Top 0.406: LED_CBUS2.C R15.1
CBUS3
  Top 0.305: IC5.11 10.28,35.67 11.91,37.31 R16.2
CBUS3_LED
  Top 0.406: LED_CBUS3.C R16.1
CBUS4
  Top 0.305: IC5.9 11.37,34.77 R17.2
CBUS4_LED
  Top 0.406: LED_CBUS4.C R17.1
CS_DECA  (via drill 0.3)  (2 unrouted)
  Top 0.305: v3.81,2.7 3.81,1.59 4.34,1.05 R23.1 | IC3.17 75.41,33.21 v75.41,31.99
  Top 0.406: JP6.4 36.2,33.66 41.27,33.66 JP4.7 JP4.8
  Bottom 0.2: 5.4,19.53 9.76,23.89 24.29,23.89 26.51,26.11 26.51,29.37 28.73,31.59
  Bottom 0.305: 5.4,19.53 5.4,3.49 4.6,2.7 v3.81,2.7 | 28.73,31.59 28.73,33.81 JP2.4 | JP7.4 50.16,34.29 51.44,33.02 51.44,30.24 52.07,29.61 73.03,29.61 v75.41,31.99
CS_MPU
  Bottom 0.2: MPU9250.22 16.95,16.87 17.3,16.51 19.05,16.51 19.27,16.3 R31.1
CS_MPU2  (via drill 0.3)  (2 unrouted)
  Top 0.305: R24.1 v2.38,3.97
  Top 0.406: JP6.3 36.2,36.2 41.27,36.2 JP4.5 JP4.6 | v69.22,17.94 69.22,22.07 67.47,23.81 61.04,23.81 59.85,25 59.85,25.72 57.07,28.5 57.07,34.37 53.98,37.47 53.98,38.1 53.34,38.73 52.07,38.73 50.8,37.47 JP7.3
  Bottom 0.2: 4.76,19.68 9.37,24.29 24.13,24.29 26.11,26.27 26.11,29.53 28.1,31.51 28.1,31.67
  Bottom 0.305: v2.38,3.97 4.29,3.97 4.76,4.45 4.76,19.68 | 28.1,31.67 28.1,35.72 JP2.3
  Bottom 0.406: v69.22,17.94 70.48,16.67 MPU9250_L.6
EN  (via drill 0.3)
  Top 0.305: U1.3 22.4,3.95 v22.38,3.97 | v20,5.4 8.57,5.4 v8.26,5.71 | v12.06,21.99 7.54,21.99 6.91,22.62 6.91,26.11 v7.3,26.51
  Bottom 0.305: v20,5.4 20.95,5.4 v22.38,3.97 23.28,3.07 C2.1 24.82,3.02 25.56,3.02 25.88,2.7 25.88,1.75 26.25,1.37 R11.2 | v8.26,5.71 7.94,6.03 7.94,12.54 9.21,13.81 9.21,15.88 9.53,16.19 9.53,18.1 11.27,19.84 11.27,21.19 v12.06,21.99 | T3.3 7.46,26.67 v7.3,26.51
GND  (via drill 0.3, 0.9)  (3 unrouted)
  Top 0.2: IC1.2 10.48,27.23 10.56,27.3 | C8.2 7.86,25.96 9.29,27.38 | 15.36,27.27 15.4,27.3 | 19.76,27.46 19.68,27.46 | v14.13,21.43 14.68,21.99 15.48,21.99 | 15.48,21.99 15.8,21.99 16.03,21.75 19.84,21.75 | 19.84,21.75 20.8,21.75 v20.95,21.59 | IC4.1 19.95,25.03 19.76,24.84 19.76,21.83 19.84,21.75 | IC4.7 18.1,24.38 | 18.1,24.38 17.31,24.38 17.3,24.37 | 17.33,27.28 17.3,27.3 | 17.3,24.37 17.3,25.88 17.62,26.19 C1.2 18.28,27.2 18.18,27.3 | IC4.5 18.28,23.08 18.1,23.26 18.1,24.38 | 15.48,21.99 15.46,22.01 C17.1 16.75,23.81 17.3,24.37 | v68.98,40.56 68.42,41.12 | 68.42,41.12 67.47,42.07 | 67.47,42.07 66.79,42.74 v65.36,42.74 | v64.85,39.05 64.29,39.61 64.29,40.32 64.69,40.72 66.12,40.72 67.47,42.07 | v69.29,41.99 68.42,41.12 | U$5.P$25 91.19,9.75 90.92,9.48 U$5.P$2 89.03,9.71 88.27,10.48 88.27,12.22 87.63,12.86 86.12,12.86 85.83,13.15 C26.2 | R46.1 85.96,17.54 JPGND.1 | C28.2 88.9,16.27 v89.61,16.99 | C27.2 94.14,13.12 v94.14,15.88
  Top 0.305: IC5.26 8.28,28.59 8.18,28.5 | 8.18,28.5 8.1,28.42 7.46,28.42 6.92,28.95 IC5.24 5.78,30.32 C22.2 C19.2 | IC5.20 6.18,32.32 C19.2 | 8.18,28.5 9.29,27.38 9.37,27.3 10.56,27.3 15.4,27.3 v16.19,27.3 | U1.GND 16.33,8.71 v16.03,8.41 | X3.5 7.78,38.78 7.78,37.62 7.62,37.47 v6.03,37.47 5.4,37.47 4.87,36.93 C18.2 4.87,34.98 | IC5.17 6.92,34.19 6.83,34.29 5.56,34.29 4.87,34.98 | C19.2 3.81,33.44 3.81,34.45 4.34,34.98 4.87,34.98 | v18.89,38.1 18.89,34.13 18.57,33.81 13.65,33.81 13.18,33.34 13.18,31.75 | v16.19,27.3 17.3,27.3 18.18,27.3 v19.05,27.3 19.53,27.3 19.68,27.46 22.23,30 v23.02,30 23.02,30.88 26.51,34.37 v26.51,35.88 | 20.48,1.41 U1.1 29.35,1.41 JP2.17 | 20.48,1.41 8.26,1.41 | 8.26,1.41 U1.38 | v20.48,0.95 20.48,1.41 | v8.26,2.22 8.26,1.41 | v20.16,9.21 17.78,9.21 v17.3,9.68 | U1.15 22.52,19.66 23.18,20.32 v23.18,20.64 | C21.2 23.71,38.68 24.29,38.1 26.99,38.1 v27.3,37.78 | v16.19,27.3 16.19,28.26 13.18,31.27 13.18,31.75 | IC5.4 13.11,31.82 13.18,31.75 | MPU9250_R.5 66.75,20.88 63.58,20.88 61.44,23.02 60.72,23.02 57.86,25.88 v57.86,26.27 | C26.2 C30.2 C29.2 84.69,16.27 JPGND2.1 | 86.28,2.33 SJ2.1 86.38,2.37 C25.2 v85.41,3.97 | JP25.1 53.5,40.8 55.4,40.8 | 55.4,40.8 v56.36,40.8 | RADIO_PORT.6 57.71,29.92 57.71,34.61 55.4,36.91 55.4,40.8
  Top 0.406: U3.P$2 v23.81,41.91 23.71,41.81 C21.2 | 23.81,39.63 C21.2 | C20.2 C21.2 | JP3.1 1.43,2.38 1.43,42.07 JP1.1 | JP6.17 36.2,0.64 41.27,0.64 JP4.33 JP4.34 | 70.56,1.85 R1002.2 69.77,1.83 | X2.G@1 61.12,4.52 60.25,5.4 v54.85,5.4 54.13,4.68 X2.G@2 53.92,1.91 JP7.17 | R1003.2 69.77,1.83 | 69.77,1.83 v69.77,2.86 | C6.1 75.49,15.52 B1.P$2 | C11.1 75.49,11.35 B2.P$2
  Bottom 0.2: MPU9250.11 17.75,21.55 17.94,21.75 19.84,21.75 20.48,21.11 | 20.48,21.11 20.8,20.8 20.8,19.84 | 20.8,19.84 20.8,18.73 20.58,18.52 C9.2 19.85,18.37 MPU9250.18 18.84,17.42 18.41,16.99 17.94,16.99 17.75,17.18 MPU9250.20 | C10.2 14.29,21.27 v14.13,21.43 | v20.95,21.59 20.48,21.11 | C12.2 22.01,19.84 20.8,19.84 | v23.02,30 23.34,30.32 24.45,30.32 25.24,31.11 C14.2 | U$4.2 13.93,27.42 14.29,27.78 15.21,27.78 C13.2 | U$3.P$1 65.89,41.82 65.36,42.35 v65.36,42.74 65.36,42.78 65.22,42.92 C3.1 | U$3.P$6 v68.98,40.56 68.48,40.06 U$3.P$7 | C4.2 64.4,38.2 64.85,38.66 v64.85,39.05 | 69.59,42.28 v69.29,41.99
  Bottom 0.305: CHARGER.20 21.95,31.39 23.02,30.32 v23.02,30 | U$2.G2 U$2.G1 7.78,2.7 v8.26,2.22 | v6.03,37.47 6.19,37.62 R36.1 | C16.2 18.29,37.49 v18.89,38.1 | C13.2 v16.19,27.3 | R38.2 19.42,26.93 v19.05,27.3 | R7.1 26.41,13.49 27.46,13.49 | 27.46,13.49 27.46,18.73 27.09,19.11 R6.1 25.72,20.64 24.13,22.23 23.18,22.23 23.02,22.07 23.02,20.8 v23.18,20.64 23.18,20.32 22.7,19.84 22.12,19.84 C12.2 | 27.46,13.49 27.46,8.89 26.99,8.41 23.06,8.41 U$2.G3 20.48,9.53 v20.16,9.21 | U$2.G4 v20.48,0.95 | 15.24,7.62 15.9,6.96 U$2.P6 15.9,4.26 16.67,3.49 19.05,3.49 19.84,2.7 U$2.G4 | C2.2 22.92,1.37 21.59,2.7 U$2.G4 | v26.51,35.88 27.3,36.67 v27.3,37.78 | 16.32,36.51 16.22,36.51 C15.2 | R20.2 R14.2 R13.2 R12.2 | U$1.GND 62.52,25.11 RADIO_PORT.6 58.9,27.3 v57.86,26.27 | C3.1 58.48,42.92 v56.36,40.8 | v85.41,3.97 85.09,4.29 85.09,17.14 | 85.09,17.14 JPGND2.1 | JP10.1 87.91,18.69 | 87.91,18.69 87.63,18.41 85.72,18.41 85.41,18.1 | 85.41,18.1 85.09,17.78 85.09,17.14 | JPGND.1 85.41,18.1 | JPGND1.1 97.79,15.88 v94.14,15.88 90.73,15.88 v89.61,16.99 87.91,18.69
  Bottom 0.406: v23.81,41.91 24.45,41.27 25.4,41.27 25.88,40.8 C23.2 | R36.1 R26.1 R35.1 R34.1 | R4.1 C14.2 | JP3.1 4.92,1.91 5.71,2.7 U$2.G1 | 77.84,42.28 JP8.1 78,42.44 R12.2 | X2.G@2 54.13,4.68 v54.85,5.4 60.25,5.4 60.52,5.13 U$1.GND_RF 61.12,2.98 X2.G@1 61.33,1.91 69.77,1.91 | 69.77,1.91 JP9.1 78.9,2.7 78.9,13.41 | v69.77,2.86 69.77,1.91 | 78.9,13.41 78.9,31.59 78,32.49 R20.2 | B2.P$2 76.34,13.41 | 76.34,13.41 78.9,13.41 | 76.34,13.41 76.34,14.63 B1.P$2
  Bottom 0.813: 16.32,36.51 C16.2 | BATT_CON_SW.4 16.19,39.05 C15.2
  Bottom 1.016: v17.3,7.14 v16.03,8.41 | v16.03,8.41 v17.3,9.68 | v16.03,8.41 v14.76,9.68 | v14.76,7.14 15.24,7.62 v16.03,8.41
  pour Bottom (rank 3): 0,44.45 31.11,44.45 31.11,0 0,0
  pour Top (rank 3): 0,44.45 31.11,44.45 31.11,0 0,0
  pour Top: 48.9,44.45 80.01,44.45 80.01,0 48.9,0
  pour Bottom: 48.9,44.45 80.01,44.45 80.01,0 48.9,0
  pour Bottom: 33.66,44.45 46.35,44.45 46.35,0 33.66,0
  pour Top: 33.66,44.45 46.35,44.45 46.35,0 33.66,0
  pour Top: 82.55,20.95 100.33,20.95 100.33,0 82.55,0
  pour Bottom: 82.55,20.95 100.33,20.95 100.33,0 82.55,0
IO0_!RST  (via drill 0.3)
  Top 0.305: v5.4,23.81 5.4,20 6.78,18.62 U1.25
  Bottom 0.305: T4.3 9.7,30.33 9.05,29.69 9.05,26.35 6.51,23.81 v5.4,23.81
IO5  (via drill 0.3)
  Top 0.305: U1.29 9.06,12.84 9.84,12.06 11.91,12.06 12.54,11.43 v12.54,10.16
  Bottom 0.305: R31.2 17.57,15.03 17.14,14.61 13.97,14.61 13.34,13.97 13.34,12.22 12.54,11.43 v12.54,10.16
IO16  (via drill 0.3)
  Top 0.305: U1.27 7.76,15.38 8.41,16.03 8.41,16.35 v8.73,16.67
  Bottom 0.305: v8.73,16.67 8.47,16.93 R33.2
IO17  (via drill 0.3)
  Top 0.305: U1.28 8.08,14.11 8.1,14.13 v8.26,14.13
  Bottom 0.305: R32.2 8.15,14.23 v8.26,14.13
IO18  (via drill 0.3)
  Top 0.305: U1.30 9.22,11.57 9.37,11.43 11.27,11.43 v11.75,10.95
  Bottom 0.305: R30.2 14.13,15.72 12.7,14.29 12.7,12.38 11.75,11.43 v11.75,10.95
IO19  (via drill 0.3)
  Top 0.305: U1.31 6.96,10.48 v10.64,10.48
  Bottom 0.305: R29.2 11.21,15.61 12.06,14.76 12.06,12.54 10.64,11.11 v10.64,10.48
IO21
  Top 0.813: R28.2 6.77,7.78 U1.33
IO22
  Top 0.813: R24.2 6.77,3.97 U1.36
IO23
  Top 0.5: R23.2 5.15,2.68 U1.37
  Top 0.813: 6.77,2.7 U1.37
IO26  (via drill 0.3)
  Top 0.305: v23.97,14.13 23.99,14.11 U1.11
  Bottom 0.305: R40.1 v23.97,14.13
IO27  (via drill 0.3)
  Top 0.305: v23.97,15.4 23.99,15.38 U1.12
  Bottom 0.305: R22.1 v23.97,15.4
IO34  (via drill 0.3)
  Top 0.305: v22.38,7.78 25.27,7.78 U1.6
  Bottom 0.305: R3.1 22.7,7.46 v22.38,7.78
LED4  (via drill 0.3)  (2 unrouted)
  Top 0.305: U1.8 23.99,10.3 v23.97,10.32 | v26.67,15.56 28.26,15.56 JP2.11
  Top 0.406: JP6.11 36.2,15.88 41.27,15.88 JP4.21 JP4.22
  Bottom 0.305: v23.97,10.32 24.92,10.32 25.4,10.79 25.4,14.49 LED4.A 25.92,14.81 v26.67,15.56
LED5  (via drill 0.3)
  Top 0.305: U1.7 25.27,9.05 24.29,9.05 v23.97,9.37
  Bottom 0.305: LED5.A 24.09,9.25 v23.97,9.37
LED_3V1
  Bottom 0.406: R6.2 LED4.C
LED_3V2
  Bottom 0.406: R7.2 LED5.C
LED_3V3
  Bottom 0.406: R26.2 8.11,40.38 LED_VCCIO.C
LED_3V3_USB
  Bottom 0.406: R36.2 5.89,40.38 LED_USB.C
LED_3V3_USB1
  Bottom 0.406: LED_3V3.C 10.33,40.38 R35.2
LED_3V3_USB2
  Top 0.2: R46.2 89.3,17.54 90.17,18.41 92.23,18.41 92.39,18.26 92.39,17.74 LED_BMF055.C
LED_3V4
  Bottom 0.406: LED_5V.C 12.55,40.38 R34.2
MISO0  (via drill 0.3)  (2 unrouted)
  Top 0.2: v12.06,17.3 14.29,17.3 14.92,17.94 20.32,17.94 20.95,18.57 22.38,18.57 24.77,20.95 24.77,22.7 25.32,23.26 v26.35,23.26
  Top 0.305: IC3.19 76.92,36.27 77.79,35.4 77.79,25.72 72.55,20.48 72.55,19.45 v69.37,16.27 53.66,16.27 53.02,16.91 v53.02,19.61
  Top 0.406: JP6.8 36.2,23.5 41.27,23.5 JP4.15 JP4.16
  Bottom 0.2: MPU9250.24 13.65,17.67 12.91,16.93 | R29.1 12.91,16.93 | 12.91,16.93 12.54,17.3 v12.06,17.3
  Bottom 0.305: JP2.8 28.34,23.26 v26.35,23.26 | MPU9250_L.4 68.5,10.08 68.5,15.4 v69.37,16.27 | v53.02,19.61 53.02,20.72 51.44,22.3 51.44,23.5 JP7.8
MOSI0  (via drill 0.3)  (2 unrouted)
  Top 0.2: v5.56,25.88 6.27,25.16 6.27,21.91 6.75,21.43 11.51,21.43 11.83,21.11 v12.54,21.11
  Top 0.305: R28.1 v2.38,7.78 | IC3.18 76.66,34.87 76.99,34.53 76.99,32.07 v76.2,31.27
  Top 0.406: JP6.7 36.2,26.04 41.27,26.04 JP4.13 JP4.14
  Bottom 0.2: 16.91,22.7 13.65,22.7 12.94,21.99 12.94,21.51 v12.54,21.11 | 16.91,22.7 24.77,22.7 29.37,27.3 JP2.7 | MPU9250.9 16.95,22.66 16.91,22.7
  Bottom 0.305: v2.38,7.78 2.86,8.26 2.86,23.18 v5.56,25.88 | v76.2,31.27 73.98,29.05 | 73.98,29.05 51.91,29.05 JP7.7 | MPU9250_L.3 64.14,5.71 71.2,5.71 72.47,6.99 72.47,23.34 74.37,25.24 74.37,28.65 73.98,29.05
MPU_RX  (via drill 0.3)  (2 unrouted)
  Top 0.305: v28.1,29.37 28.1,30.64 JP2.5 | v66.67,11.03 69.22,11.03 73.1,7.14 73.1,1.83
  Top 0.406: JP6.5 36.2,31.11 41.27,31.11 JP4.9 JP4.10 | R1002.1 73.1,1.83 R1000.2 73.98,1.85 | MPU9250_R.3 62.87,20.32 60.96,22.23 60.4,22.23 56.44,26.19 56.44,34.05 54.29,36.2 52.07,36.2 51.44,35.56 51.44,34.29 50.16,33.02 JP7.5
  Bottom 0.2: 6.03,19.37 10.16,23.5 24.45,23.5 28.1,27.15 v28.1,29.37
  Bottom 0.305: R32.1 6.03,15.98 6.03,19.37 | MPU9250_R.3 66.67,15.88 v66.67,11.03
MPU_TX  (via drill 0.3)  (2 unrouted)
  Top 0.406: JP6.6 36.2,28.57 41.27,28.57 JP4.11 JP4.12 | R1003.1 R1001.2 65.48,1.88 65.48,4.92 64.14,6.27 v64.14,8.41 | MPU9250_R.4 64.14,18.41 62.15,18.41 61.59,18.97 61.59,20.32 60.56,21.35 59.69,21.35 55.8,25.24 55.8,32.62 54.77,33.66 52.07,33.66 51.44,33.02 51.44,31.11 JP7.6
  Bottom 0.2: R33.1 11.61,23.1 24.61,23.1 28.57,27.07 28.57,28.57 JP2.6
  Bottom 0.305: v64.14,8.41 65.56,8.41 67.63,10.48 67.63,17.46 MPU9250_R.4
N$3
  Bottom 0.813: JP5.1 JP5.3 JP5.5 JP5.7 JP5.9 JP5.11 JP5.13 JP5.15 JP5.17 JP5.19 JP5.21 JP5.23 JP5.25 JP5.27 JP5.29 JP5.31 JP5.33
N$5
  Bottom 0.2: MPU9250.10 17.34,21.71 17.86,22.23 21.91,22.23 22.07,22.07 C12.1
N$8  (via drill 0.3)
  Top 0.305: v19.05,29.53 20.64,31.11 20.64,39.05 BATT_CON_SW.3
  Bottom 0.2: CHARGER.12 CHARGER.13 CHARGER.14 20.19,35.62 C16.1
  Bottom 0.305: CHARGER.4 19.18,29.65 v19.05,29.53
  Bottom 0.813: C16.1 21.09,38.6 BATT_CON_SW.3
  pour Bottom (no thermals): 19.21,33.97 20.32,33.97 20.32,34.92 20.64,35.24 21.43,35.24 21.75,35.56 21.75,37.62 19.68,37.62 19.68,35.56 19.21,35.08
N$9
  Bottom 0.813: BATT_CON_SW.2 BATT_CON_SW.1
N$10
  Bottom 0.305: CHARGER.18 R4.2
N$14
  Bottom 0.305: CHARGER.15 21.25,34.27 21.59,34.61 22.54,34.61 22.7,34.77 LED6.C
N$15
  Top 0.2: U$5.P$6 88.88,7.09 88.19,7.78 R21.1
N$16
  Bottom 0.406: X2.1 58.52,3 U$1.ANT
N$17
  Bottom 0.305: CHARGER.19 22.57,31.88 23.34,31.11 C14.1
N$18
  Bottom 0.305: LED6.A 22.76,37.68 R5.1
N$20
  Bottom 0.305: CHARGER.5 18.28,30.5 17.94,30.16 R37.1
N$21
  Bottom 0.305: CHARGER.3 19.68,29.69 20.16,29.21 R38.1
N$22
  Bottom 0.305: CHARGER.2 20.19,29.97 20.64,29.53 21.27,29.53 21.59,29.21 R39.1
N$30
  Bottom 0.813: JP5.34 JP5.32 JP5.30 JP5.28 JP5.26 JP5.24 JP5.22 JP5.20 JP5.18 JP5.16 JP5.14 JP5.12 JP5.10 JP5.8 JP5.6 JP5.4 JP5.2
N$33
  Bottom 0.305: LED1.C R20.1
N$34
  Bottom 0.305: LED2.C R14.1
N$52
  Bottom 0.305: LED3.C R13.1
N$53
  Top 0.406: IC3.22 75.16,40.48 77.47,40.48 TP16.TP
N$54
  Top 0.2: U$5.P$5 88.54,7.98 87.95,8.57 87,8.57 86.5,9.07 R41.1
N$55
  Top 0.406: IC3.24 73.59,43.27 73.34,43.02 73.34,41.83 | 73.34,41.83 73.34,39.05 | 73.34,39.05 75.13,39.05 IC3.21 | IC3.23 73.38,41.87 73.34,41.83 | IC3.16 73.8,32.33 73.34,32.78 73.34,34.29 | 73.34,34.29 73.34,39.05 | C24.1 60.59,33.47 IC3.8 64.1,33.47 64.93,34.29 73.34,34.29
N$56
  Top 0.406: IC3.5 64.17,37.67 64.45,37.39 64.45,36.27 | 64.45,36.27 64.45,35.16 64.16,34.87 IC3.7 60.52,34.87 C24.2 | IC3.6 64.44,36.27 64.45,36.27
N$57
  Top 0.2: U$5.P$4 88.59,8.48 88.11,8.97 87.15,8.97 87.07,9.05 R42.1
N$58
  Bottom 0.305: LED7.C R12.1
N$59  (via drill 0.3)
  Top 0.305: IC3.12 68.2,33.03 v68.5,33.34
  Bottom 0.305: LED7.A 72.63,37.86 68.5,33.73 v68.5,33.34
N$60  (via drill 0.3)
  Top 0.305: IC3.13 69.6,33.24 v69.69,33.34
  Bottom 0.305: LED3.A 72.47,36.35 69.69,33.58 v69.69,33.34
N$61
  Bottom 0.2: U$3.P$2 66.66,42.72 TP5.TP
N$62
  Bottom 0.2: U$3.P$3 67.16,42.32 67.55,42.7 TP6.TP
N$63
  Bottom 0.2: U$3.P$10 66.66,37.95 TP7.TP
N$64
  Bottom 0.2: U$3.P$11 65.89,39.3 65.56,38.97 TP8.TP
N$65
  Bottom 0.2: U$3.P$4 67.94,41.82 68.58,42.47 TP4.TP
N$66
  Bottom 0.2: U$3.P$9 67.16,38.8 67.79,38.18 TP3.TP
N$67  (via drill 0.3)
  Top 0.305: IC3.14 71,33.22 v70.88,33.34
  Bottom 0.305: LED2.A 72.23,34.85 70.88,33.5 v70.88,33.34
N$70  (via drill 0.3)
  Top 0.305: IC3.15 72.4,33.01 v72.07,33.34
  Bottom 0.305: LED1.A v72.07,33.34
N$71  (via drill 0.3)
  Top 0.305: IC3.11 66.8,32.73 v67.39,33.32
  Bottom 0.305: v67.39,33.32 67.39,33.97 66.36,35 58.42,35 57.23,33.81 TP10.TP
N$72
  Top 0.305: IC3.3 62.63,40.48 60.8,40.48 59.93,39.61 TP9.TP
N$73  (via drill 0.3)
  Top 0.305: IC3.10 65.4,32.47 v66.28,33.35
  Bottom 0.305: v66.28,33.35 66.28,33.73 65.8,34.21 60.09,34.21 59.69,33.81 TP11.TP
N$74  (via drill 0.3)
  Top 0.305: IC3.9 64,32.17 v65.17,33.34
  Bottom 0.305: v65.17,33.34 64.53,32.7 TP12.TP
N$75
  Top 0.305: IC3.4 62.63,39.05 61.04,39.05 60.56,38.58 60.56,38.1 59.93,37.47 TP13.TP
N$76
  Top 0.305: IC3.2 62.61,41.83 TP14.TP
N$77
  Top 0.305: IC3.1 56.83,43.26 TP15.TP
N$78
  Top 0.2: U$5.P$1 88.92,10.37 88.82,10.48 88.82,11.19 TP17.TP
N$79
  Top 0.2: U$5.P$8 90.19,6.61 88.82,5.24 R44.1
N$80
  Top 0.2: U$5.P$7 89.69,6.66 89.53,6.51 R45.1
N$81
  Top 0.2: U$5.P$27 90.19,12.52 88.9,13.81 C28.1 88.92,14.39 90.01,15.48 90.41,15.48 90.81,15.88 90.81,17.05 Q1.4
N$82
  Top 0.2: U$5.P$26 90.69,11.07 90.57,11.19 90.57,13.61 Q1.1 90.85,13.89 91.44,13.89 92.23,13.1 C27.1
N$83
  Top 0.2: U$5.P$18 95.52,8.98 R48.1
N$84
  Top 0.2: U$5.P$17 94.31,8.48 95.01,7.78 R49.1
N$85
  Top 0.2: U$5.P$16 94.25,7.98 94.61,7.62 94.61,6.91 95.01,6.51 R52.1
N$86
  Top 0.2: U$5.P$15 94.11,7.09 94.22,6.99 94.22,6.75 94.77,6.19 94.77,5.48 95.01,5.24 R53.1
N$87
  Top 0.2: U$5.P$14 93.19,6.66 93.42,6.43 93.98,6.43 94.38,6.03 94.38,4.6 95.01,3.97 R54.1
N$88
  Top 0.2: U$5.P$12 92.19,3.69 92.39,3.49 TP23.TP
N$89
  Top 0.2: U$5.P$10 91.19,6.5 89.38,4.68 R56.1
N$90
  Top 0.2: U$5.P$24 91.69,10.86 91.28,11.27 TP18.TP
N$91
  Top 0.2: U$5.P$23 92.19,11.7 TP19.TP
N$92
  Top 0.2: U$5.P$21 93.19,10.8 93.34,10.95 93.9,10.95 94.14,11.19 TP20.TP
N$93
  Top 0.2: U$5.P$22 92.69,10.85 93.03,11.19 93.03,11.59 TP21.TP
N$94
  Top 0.2: U$5.P$20 94.06,10.37 R61.2
N$95
  Top 0.2: U$5.P$19 94.44,9.48 R62.2
N$96
  Top 0.2: U$5.P$13 92.69,6.61 93.27,6.03 TP22.TP
N$97
  Top 0.305: LED_BMF.C 97.29,2.8 R54.2
N$99
  Top 0.2: U$5.P$9 90.69,6.55 88.11,3.97 C25.1
N$100
  Top 0.305: R64.2 92.47,1.98 91.84,2.62 91.08,2.62 SJ1.2
RADIO_CF
  Bottom 0.305: U$1.!CONFIG 66.52,24.29 63.5,27.3 RADIO_PORT.5
RADIO_EN
  Bottom 0.305: U$1.!ENABLE 68.52,24.07 68.82,24.37 71.12,24.37 73.03,26.27 RADIO_PORT.1
RADIO_RX  (via drill 0.3)  (2 unrouted)
  Top 0.305: RADIO_PORT.3 66.28,25.64 v63.5,25.64 62.63,25.64 61.59,26.67 61.59,29.53 58.82,32.31 58.82,34.37 56.52,36.67 v56.52,38.02
  Top 0.406: JP6.15 36.2,5.71 41.27,5.71 JP4.29 JP4.30
  Bottom 0.305: R1.2 27.78,4.92 JP2.15 | v63.5,25.64 64.52,24.62 U$1.DRX 64.52,21.1 64.21,20.8 62.07,20.8 61.59,20.32 61.59,15.08 53.5,6.99 JP7.15 | JP27.1 54.77,34.92 56.52,36.67 v56.52,38.02
RADIO_TX  (via drill 0.3)  (2 unrouted)
  Top 0.305: v61.59,24.69 67.87,24.69 RADIO_PORT.2 | v52.7,27.94 JP28.1
  Top 0.406: JP6.14 36.2,8.26 41.27,8.26 JP4.27 JP4.28
  Bottom 0.305: R2.2 26.51,6.19 JP2.14 | U$1.DTX 60.52,24.65 60.48,24.69 | 60.48,24.69 v61.59,24.69 | 60.48,24.69 53.34,24.69 | 53.34,24.69 52.86,24.21 52.86,23.34 55.01,21.19 55.01,14.37 JP7.14 | 53.34,24.69 53.34,27.3 v52.7,27.94
RXD0  (via drill 0.3)
  Top 0.305: IC5.30 10.28,28.69 v9.84,28.26 | R27.1 v2.38,6.51
  Bottom 0.305: v9.84,28.26 9.84,26.35 3.49,20 3.49,6.99 3.02,6.51 v2.38,6.51
RXD0_
  Top 0.813: R27.2 6.77,6.51 U1.34
SCK0  (via drill 0.3)  (2 unrouted)
  Top 0.2: v15.24,16.83 15.88,17.46 20.48,17.46 21.11,18.1 22.46,18.1 25.56,21.19 v25.56,22.46
  Top 0.305: IC3.20 76.87,37.67 78.98,35.56 78.98,25.8 73.42,20.24 73.42,15.32 73.1,15 v69.45,15 68.82,15.64 53.5,15.64 52.47,16.67 52.47,18.57 v52.15,18.89
  Top 0.406: JP6.9 36.2,20.95 41.27,20.95 JP4.17 JP4.18
  Bottom 0.2: MPU9250.23 16.55,16.86 16.14,16.45 16.09,16.45 | R30.1 16.09,16.45 | 16.09,16.45 15.72,16.83 v15.24,16.83
  Bottom 0.305: JP2.9 29.61,22.46 v25.56,22.46 | v69.45,15 69.45,8.49 MPU9250_L.5 | JP7.9 50.48,22.23 52.15,20.56 v52.15,18.89
SCL0  (via drill 0.3)  (2 unrouted)
  Top 0.2: v20,14.45 19.37,15.08 19.37,16.51 19.84,16.99 21.91,16.99 26.35,21.43 v26.35,21.75 26.67,21.75 27.62,22.7 27.62,27.38 25.32,29.69 v24.92,29.69 | IC1.6 11.88,23.55 12.06,23.73 12.06,25.32 12.46,25.72 15.56,25.72 16.19,25.08 v16.19,25 16.19,25.88 v16.83,26.51 | IC4.4 21.73,23.08 22.94,24.29 v22.94,25.4 | v64.85,41.43 64.61,41.67 64.61,43.34 64.93,43.66 68.9,43.66 70.01,42.55 v70.01,39.53 70.01,36.35 69.14,35.48 65.88,35.48 v65.41,35.96 | JP7.10 50.64,19.68 55.01,24.05 v55.01,31.91
  Top 0.406: JP6.10 36.2,18.41 41.27,18.41 JP4.19 JP4.20
  Bottom 0.2: R40.2 20.32,14.13 v20,14.45 | 22.46,26.43 22.46,28.02 23.18,28.73 24.13,29.69 v24.92,29.69 | v26.35,21.75 27.78,21.75 JP2.10 | U$4.4 15.62,25.65 16.19,25.08 v16.19,25 | 22.46,26.43 22.15,26.11 17.22,26.11 v16.83,26.51 | v22.94,25.4 22.94,25.96 22.46,26.43 | U$3.P$13 65.48,40.56 64.85,41.2 v64.85,41.43 | v65.41,35.96 58.02,35.96 55.8,33.73 55.8,32.62 55.09,31.91 v55.01,31.91
  Bottom 0.305: R40.2 21.22,13.65 R9.1 | CHARGER.1 21.41,30.5 23.18,28.73
SD_CLK  (via drill 0.3)
  Top 0.305: U1.13 23.8,16.65 23.18,16.03 23.18,11.75 22.54,11.11 22.54,10.16 20.95,8.57 20.95,4.45 20,3.49 v15.4,3.49
  Bottom 0.305: U$2.P5 14.8,4.09 v15.4,3.49
SD_CMD  (via drill 0.3)
  Top 0.305: U1.23 11.59,19.65 11.59,20.64 11.27,20.95 9.53,20.95 9.21,20.64 9.21,18.57 10.16,17.62 10.16,15.4 v10.79,14.76
  Bottom 0.305: v10.79,14.76 11.43,14.13 11.43,12.7 9.84,11.11 9.84,8.73 12.54,6.03 12.54,5.36 U$2.P3
SD_DAT0  (via drill 0.3)
  Top 0.305: U1.24 10.32,19.65 10.32,18.57 10.79,18.1 10.79,16.03 12.54,14.29 18.89,14.29 v19.68,13.49
  Bottom 0.305: U$2.P7 17,4.27 17.14,4.13 18.73,4.13 19.21,4.6 19.21,13.02 v19.68,13.49
SD_DAT1  (via drill 0.3)
  Top 0.305: U1.26 7.45,16.65 8.26,17.46 9.37,17.46 9.53,17.3 9.53,14.92 10.95,13.49 v18.26,13.49
  Bottom 0.305: U$2.P8 18.1,6.19 18.57,6.67 18.57,13.18 v18.26,13.49
SD_DAT2  (via drill 0.3)
  Top 0.305: U1.14 24.11,17.92 22.54,16.35 22.54,13.65 21.59,12.7 10.48,12.7 v9.84,13.34
  Bottom 0.305: 10.32,5.24 10.38,5.3 U$2.P1 9.94,5.3 8.57,6.67 8.57,12.06 v9.84,13.34
SD_DAT3  (via drill 0.3)
  Top 0.305: U1.16 20.46,18.72 20.16,18.41 13.18,18.41 v12.86,18.1
  Bottom 0.305: v12.86,18.1 10.48,18.1 10.16,17.78 10.16,15.88 9.84,15.56 9.84,14.61 10.79,13.65 10.79,13.02 9.21,11.43 9.21,8.57 11.5,6.28 U$2.P2
SDA0  (via drill 0.3)  (2 unrouted)
  Top 0.2: v20.32,16.35 21.91,16.35 25.56,20 26.99,20 28.57,21.59 28.57,27.86 26.59,29.84 v26.59,31.04 | IC1.1 12.84,26.45 v12.86,26.43 | IC4.3 21.03,23.73 21.91,24.61 v21.91,25.4
  Top 0.305: JP2.2 28.26,38.42 28.26,31.59 27.7,31.04 v26.59,31.04
  Top 0.406: JP6.2 36.2,38.73 41.27,38.73 JP4.3 JP4.4
  Bottom 0.2: 20.9,16.35 v20.32,16.35 20.64,16.67 R10.1 | 26.51,30.96 v26.59,31.04 26.59,30.72 25.72,29.84 25.72,26.43 23.97,24.69 21.91,24.69 | 21.91,24.69 17.54,24.69 15.88,26.35 15.16,26.35 | v12.86,26.43 12.94,26.35 15.16,26.35 | U$4.3 15.13,26.39 15.16,26.35 | v21.91,25.4 21.91,24.69 | U$3.P$14 65.91,41.24 65.09,42.07 63.1,42.07 62.71,41.67 58.66,41.67 55.72,38.73 51.99,38.73 50.72,40.01 JP7.2
  Bottom 0.305: CHARGER.17 22.26,32.89 22.7,33.34 26.35,33.34 26.51,33.18 26.51,31.11 v26.59,31.04 | R22.2 21.38,15.56 R10.1
SENSOR_VN_  (via drill 0.3)
  Top 0.305: v22.38,6.51 25.27,6.51 U1.5
  Bottom 0.305: R2.1 22.7,6.19 v22.38,6.51
SENSOR_VP_  (via drill 0.3)
  Top 0.305: v22.38,5.24 25.27,5.24 U1.4
  Bottom 0.305: R1.1 22.7,4.92 v22.38,5.24
TXD0  (via drill 0.3)
  Top 0.305: R25.1 v2.38,5.24 | IC5.2 12.84,30.82 13.65,30 v13.65,29.37
  Bottom 0.305: v2.38,5.24 3.65,5.24 4.13,5.71 4.13,19.84 10.32,26.04 11.27,26.04 13.65,28.42 v13.65,29.37
TXD0_
  Top 0.813: R25.2 6.77,5.24 U1.35
USBDM  (via drill 0.3)
  Top 0.305: IC5.15 8.28,36.97 v8.26,36.99 | X3.2 9.7,37 9.75,37 v9.84,36.91
  Bottom 0.305: v8.26,36.99 9.76,36.99 v9.84,36.91
USBDP
  Top 0.305: IC5.14 8.78,35.45 9.05,35.72 X3.3
V+  (via drill 0.3)
  Top 0.305: IC5.19 6.13,32.82 C19.1 4.82,34.13 v4.6,34.13 | v6.67,28.1 6.67,28.42 6.25,28.84 C22.1 | X3.1 10.35,37.75 v10.79,37.31
  Bottom 0.2: CHARGER.6 CHARGER.7 | CHARGER.8 CHARGER.7 | 16.51,31.88 CHARGER.7
  Bottom 0.305: v6.67,28.1 5.56,29.21 5.56,34.13 | LED_USB.A 4.56,41.07 4.29,40.8 4.29,38.1 5.87,36.51 6.67,36.51 | 6.67,36.51 6.67,34.77 6.03,34.13 5.56,34.13 | 6.67,36.51 7.94,37.78 10.32,37.78 v10.79,37.31 | 5.56,34.13 v4.6,34.13
  Bottom 0.5: C13.1 16.16,31.59 13.97,31.59 13.49,32.07 13.49,34.77 10.95,37.31 v10.79,37.31
  Bottom 0.813: C13.1 16.51,31.88
  pour Bottom (no thermals): 18.1,32.38 15.56,32.38 15.56,30.64 17.62,30.64 18.1,31.11
VCCIO  (via drill 0.3)
  Top 0.305: IC5.16 7.78,35.88 v7.46,36.2 C18.1 6.57,35.62 6.03,35.08 v5.87,35.08 | LED_CBUS3.A 16.83,37.31 18.41,38.89 19.21,38.89 19.84,38.26 19.84,34.13 18.89,33.18 13.97,33.18 13.81,33.02 13.81,31.75 v14.76,30.8 | IC5.1 12.12,29.47 13.02,28.57 v14.61,28.57
  Top 0.406: LED_CBUS4.A LED_CBUS2.A LED_CBUS3.A
  Bottom 0.305: v7.46,36.2 11.11,36.2 12.86,34.45 12.86,31.75 13.81,30.8 v14.76,30.8 14.61,30.64 v14.61,28.57 | LED_VCCIO.A 7.3,41.75 6.99,42.07 4.6,42.07 3.65,41.12 3.65,37.94 5.87,35.72 v5.87,35.08

## Text on the board
tSilk: LED_3V3 | 5 | LED_3V3_USB | 4 | 3 | 2 | 1 | 0 | TX | RX | G / 5 / S / S | !SHDN | + - | 5V_USB | 4 / 2 / 0 | 5 / 3 / 1 | IO15 | S / S / S / G / 3 / 5 | IO2 | IO13 | IO0 | IO12 | + | - | I | O | C | S | W | H | IO14 | IO4 | IO27 | IO16 | IO26 | IO17 | IO25 | IO5 | IO33 | ROBOTARNA | IO18 | IO32 | IO19 | IO35 | IO21 | IO34 | RXD | SVN | TXD | SVP | RB 3-17 | IO22 | IO23 | RB RobotikaBrno.cz | github:roboticsbrno/ / RB3200-ESP32universal / CC BY-SA 4.0 | 5 / 3 / G / S / S / S | RB3200-ESP32universal v2.0